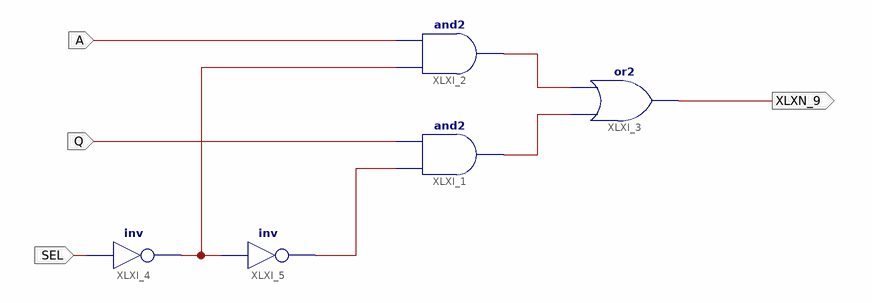
[diagram p0: schematic sheet 1]
// Xilinx ISE schematic data_selector.sch (spartan6) as structural Verilog: 5 symbols, 4 ports
module data_selector (
  input  A,
  input  Q,
  input  SEL,
  output XLXN_9
);

  wire XLXN_1, XLXN_3, XLXN_4, XLXN_5;

  and XLXI_1 (XLXN_5, XLXN_1, Q);
  and XLXI_2 (XLXN_4, XLXN_3, A);
  or XLXI_3 (XLXN_9, XLXN_5, XLXN_4);
  not XLXI_4 (XLXN_3, SEL);
  not XLXI_5 (XLXN_1, XLXN_3);
endmodule
